# Altium project xunji_Project.PrjPCB
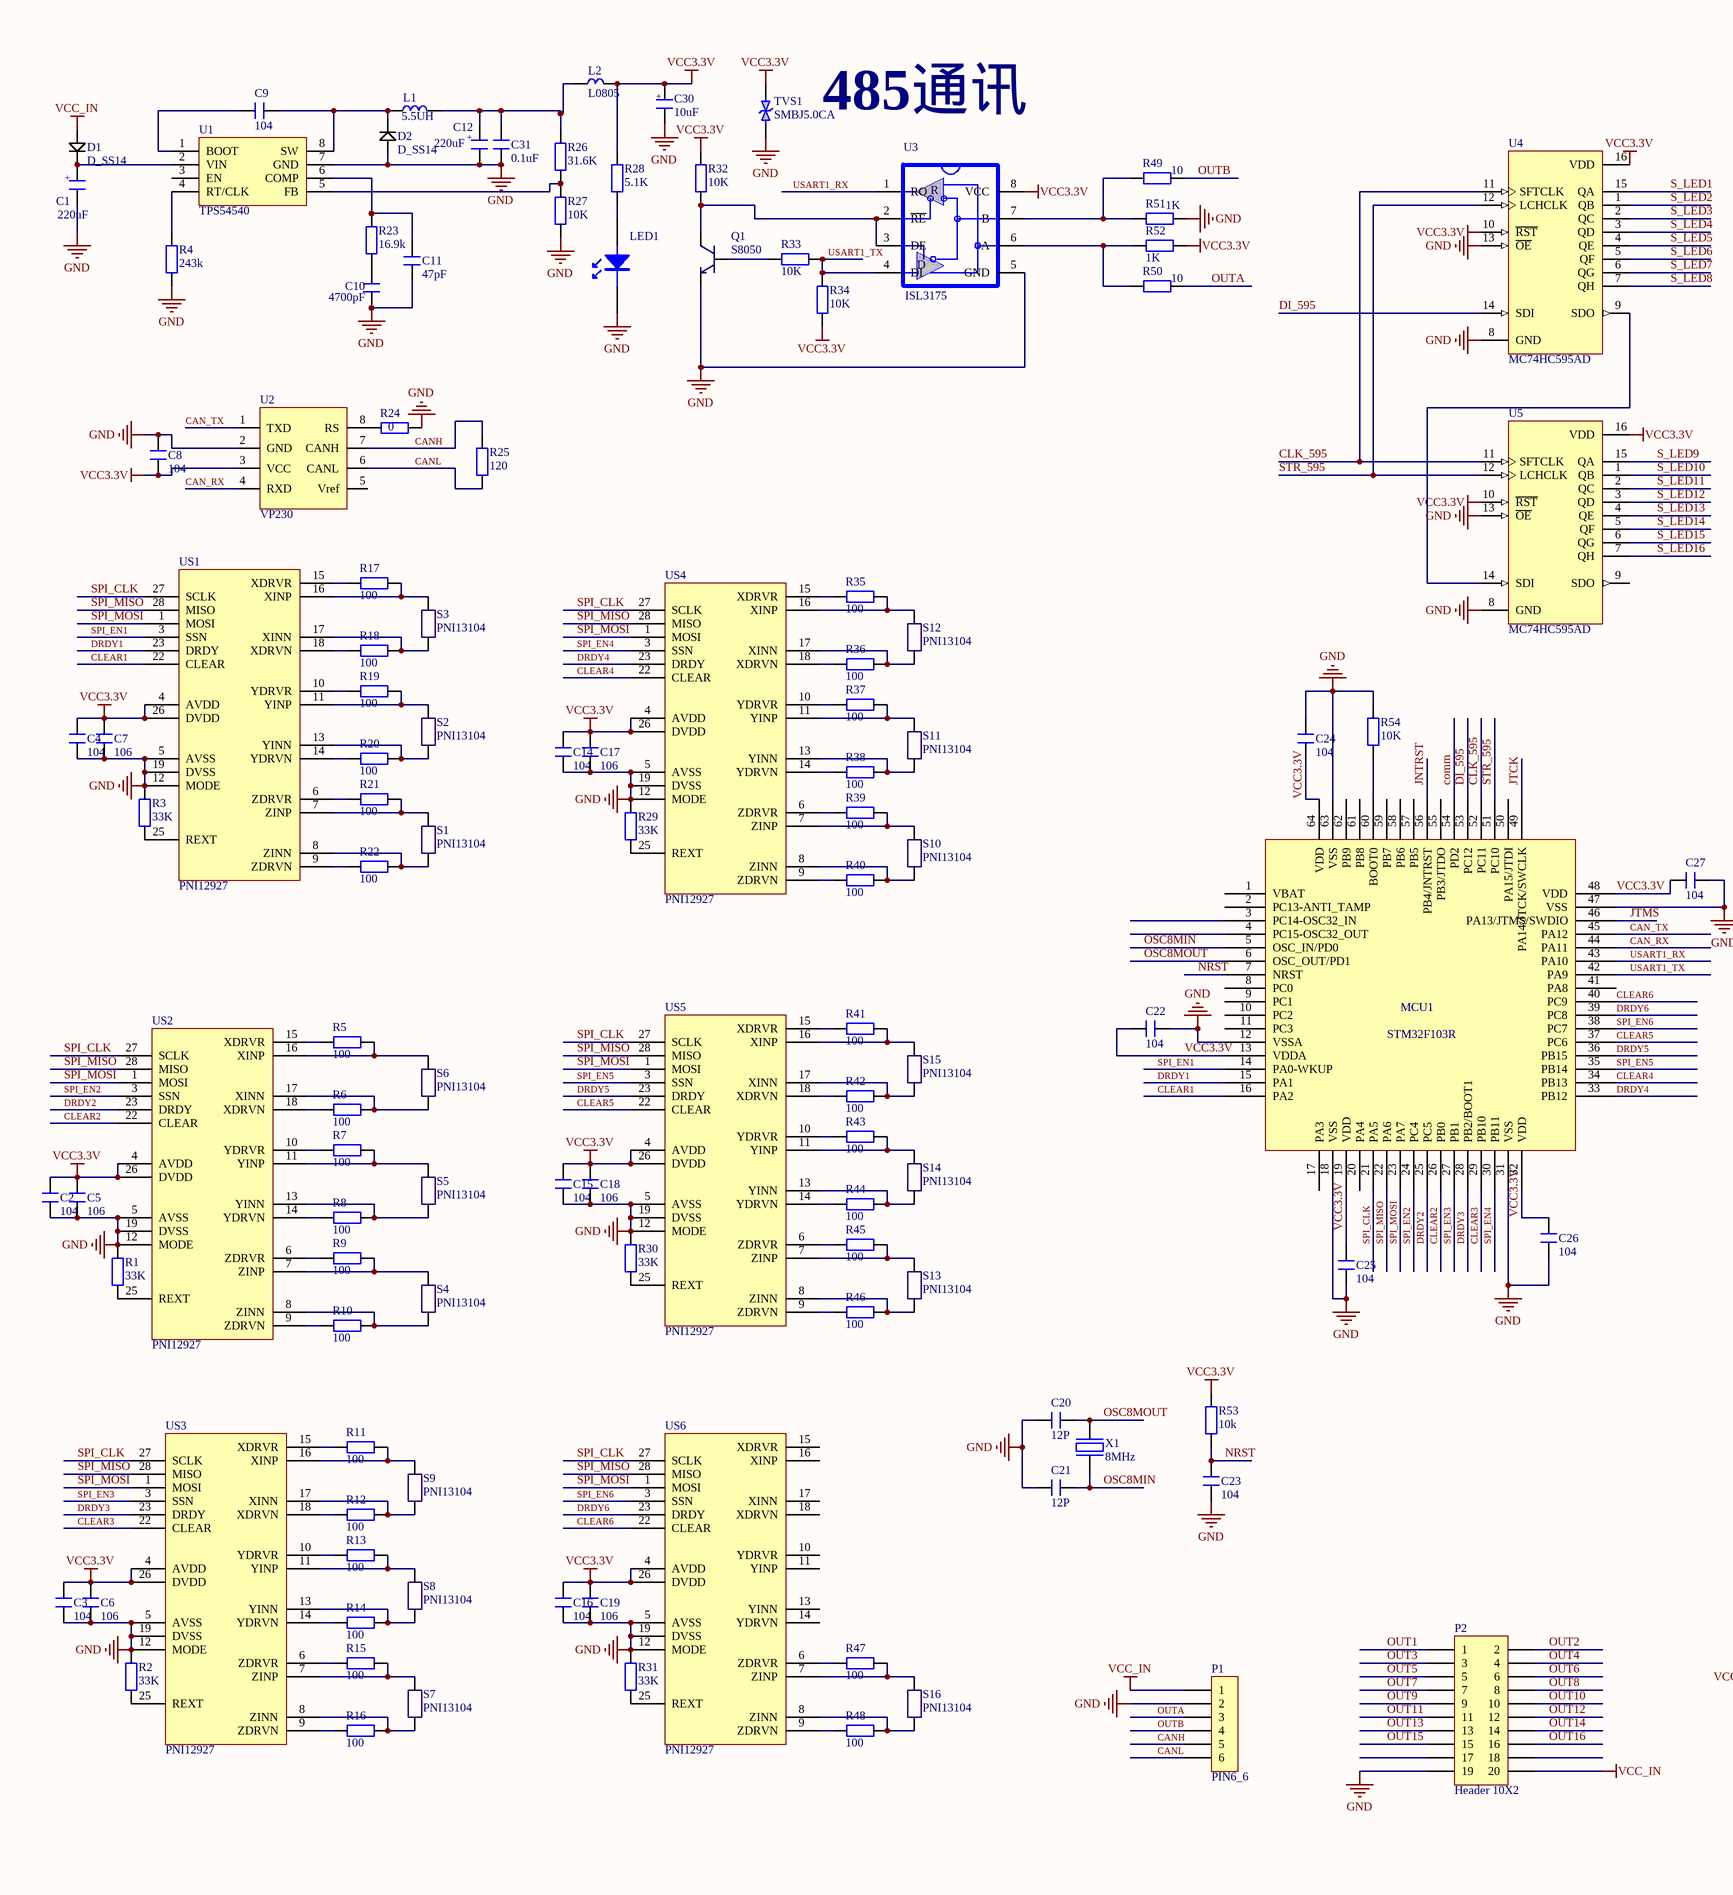
[diagram p0: MAIN.SchDoc, left]
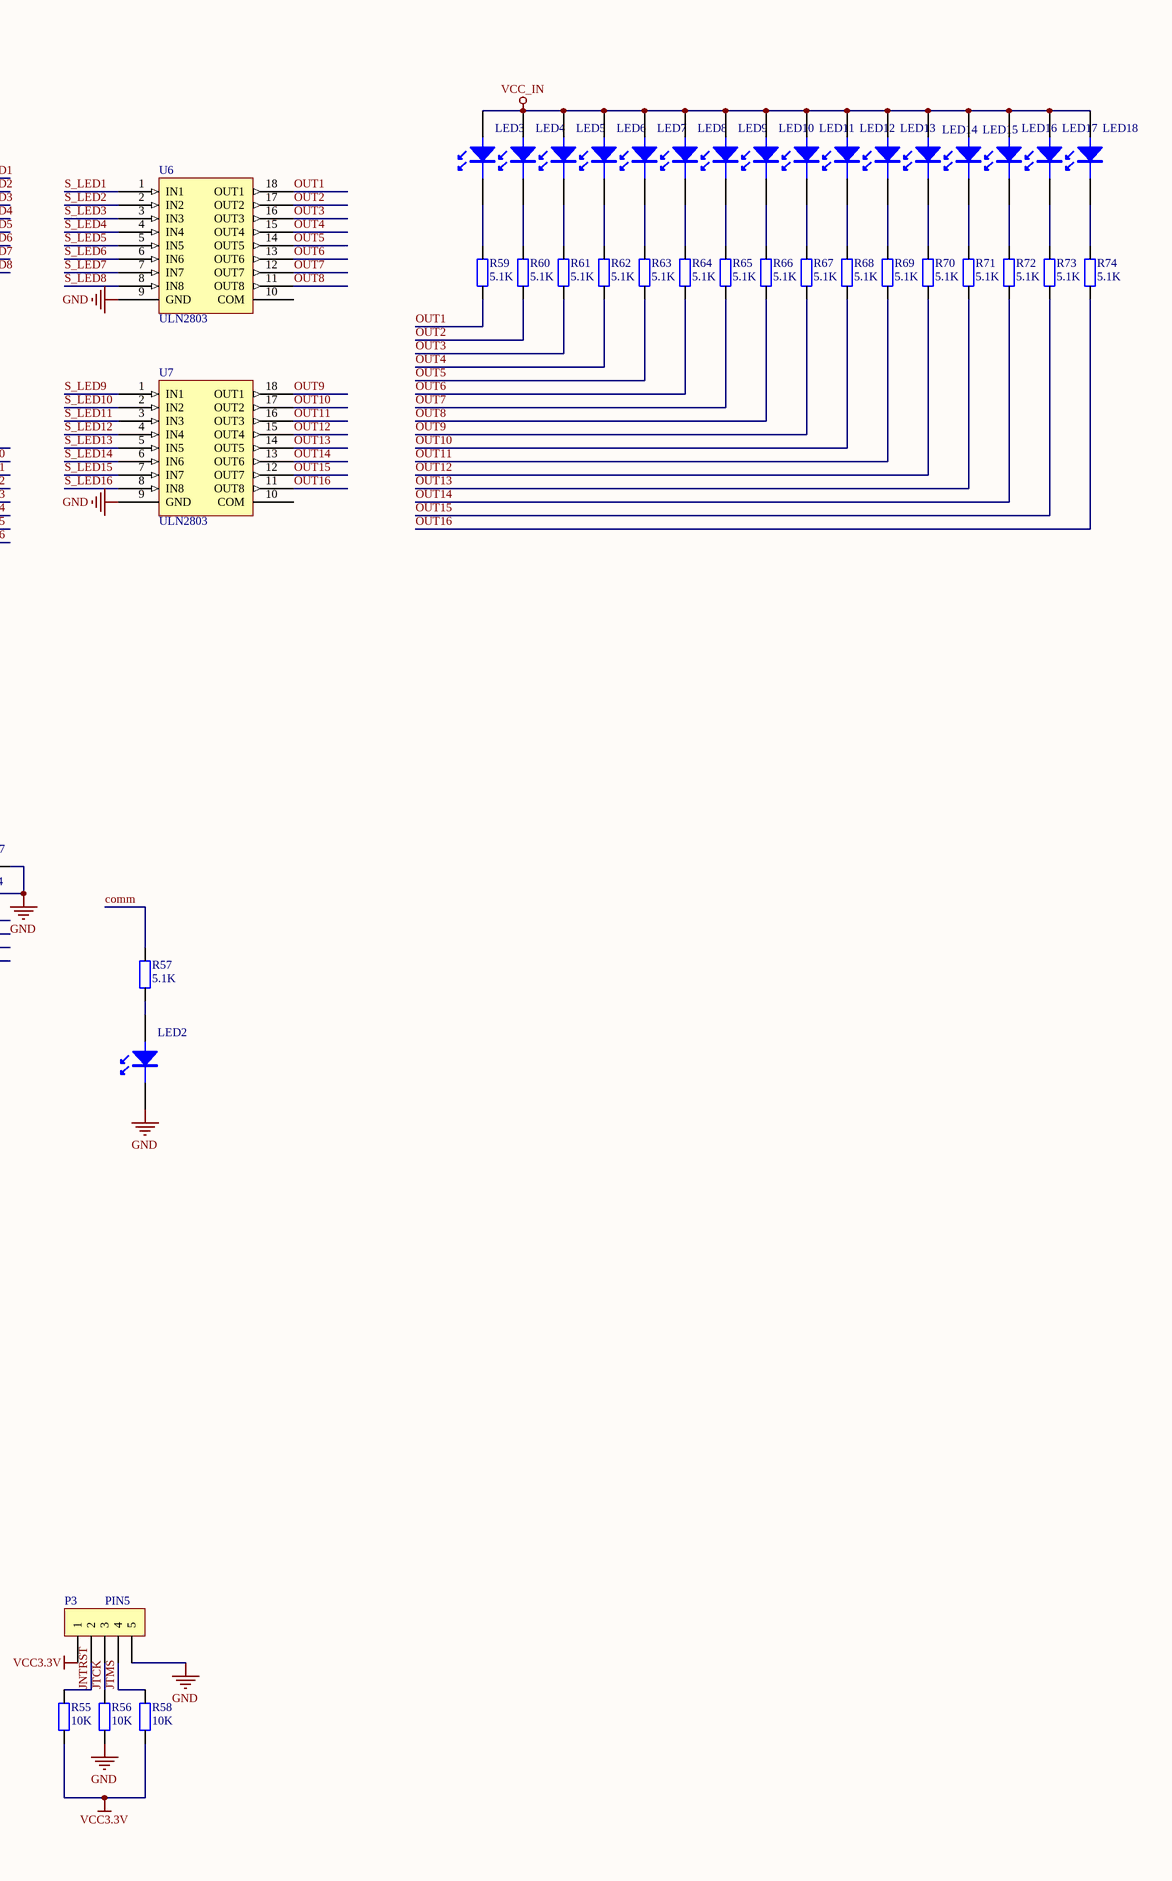
[diagram p1: MAIN.SchDoc, right]
1 sheet, 160 parts. Net scope: global (net labels, ports and power ports of the same name join across sheets).
Board file: XUNJI_V2.0.PcbDoc

## Sheet MAIN.SchDoc
size A2

### Parts
C1  220uF  [CAP_SMT_1]
C2  104  [C0603]
C3  104  [C0603]
C4  104  [C0603]
C5  106  [C0805]
C6  106  [C0805]
C7  106  [C0805]
C8  104  [C0603]
C9  104  [C0603]
C10  4700pF  [C0603]
C11  47pF  [C0603]
C12  220uF  [CAP_SMT_1]
C14  104  [C0603]
C15  104  [C0603]
C16  104  [C0603]
C17  106  [C0805]
C18  106  [C0805]
C19  106  [C0805]
C20  12P  [C0603]
C21  12P  [C0603]
C22  104  [C0603]
C23  104  [C0603]
C24  104  [C0603]
C25  104  [C0603]
C26  104  [C0603]
C27  104  [C0603]
C30  10uF  [C1206]
C31  0.1uF  [C0603]
D1  D_SS14  [D_3.0*5.0]
D2  D_SS14  [D_3.0*5.0]
L1  5.5UH  [L7*7]
L2  L0805  [L0805]
LED1  (no value)  [LED1-AK]
LED2  (no value)  [LED1-AK]
LED3  (no value)  [LED1-AK]
LED4  (no value)  [LED1-AK]
LED5  (no value)  [LED1-AK]
LED6  (no value)  [LED1-AK]
LED7  (no value)  [LED1-AK]
LED8  (no value)  [LED1-AK]
LED9  (no value)  [LED1-AK]
LED10  (no value)  [LED1-AK]
LED11  (no value)  [LED1-AK]
LED12  (no value)  [LED1-AK]
LED13  (no value)  [LED1-AK]
LED14  (no value)  [LED1-AK]
LED15  (no value)  [LED1-AK]
LED16  (no value)  [LED1-AK]
LED17  (no value)  [LED1-AK]
LED18  (no value)  [LED1-AK]
MCU1  STM32F103R  [TQFP64_STM32]
P1  PIN6_6  [KF350W_6]
P2  Header 10X2  [PIN20_10*2_2.54MM_1]
P3  PIN5  [PIN5_5*1_2.54MM_2]
Q1  S8050  [SOT-23]
R1  33K  [R0603]
R2  33K  [R0603]
R3  33K  [R0603]
R4  243k  [R0603]
R5  100  [R0603]
R6  100  [R0603]
R7  100  [R0603]
R8  100  [R0603]
R9  100  [R0603]
R10  100  [R0603]
R11  100  [R0603]
R12  100  [R0603]
R13  100  [R0603]
R14  100  [R0603]
R15  100  [R0603]
R16  100  [R0603]
R17  100  [R0603]
R18  100  [R0603]
R19  100  [R0603]
R20  100  [R0603]
R21  100  [R0603]
R22  100  [R0603]
R23  16.9k  [R0603]
R24  0  [R0603]
R25  120  [R0603]
R26  31.6K  [R0603]
R27  10K  [R0603]
R28  5.1K  [R0603]
R29  33K  [R0603]
R30  33K  [R0603]
R31  33K  [R0603]
R32  10K  [R0603]
R33  10K  [R0603]
R34  10K  [R0603]
R35  100  [R0603]
R36  100  [R0603]
R37  100  [R0603]
R38  100  [R0603]
R39  100  [R0603]
R40  100  [R0603]
R41  100  [R0603]
R42  100  [R0603]
R43  100  [R0603]
R44  100  [R0603]
R45  100  [R0603]
R46  100  [R0603]
R47  100  [R0603]
R48  100  [R0603]
R49  10  [R0603]
R50  10  [R0603]
R51  1K  [R0603]
R52  1K  [R0603]
R53  10k  [R0603]
R54  10K  [R0603]
R55  10K  [R0603]
R56  10K  [R0603]
R57  5.1K  [R0603]
R58  10K  [R0603]
R59  5.1K  [R0603]
R60  5.1K  [R0603]
R61  5.1K  [R0603]
R62  5.1K  [R0603]
R63  5.1K  [R0603]
R64  5.1K  [R0603]
R65  5.1K  [R0603]
R66  5.1K  [R0603]
R67  5.1K  [R0603]
R68  5.1K  [R0603]
R69  5.1K  [R0603]
R70  5.1K  [R0603]
R71  5.1K  [R0603]
R72  5.1K  [R0603]
R73  5.1K  [R0603]
R74  5.1K  [R0603]
S1  PNI13104  [PNI-13104]
S2  PNI13104  [PNI-13104]
S3  PNI13104  [PNI-13104]
S4  PNI13104  [PNI-13104]
S5  PNI13104  [PNI-13104]
S6  PNI13104  [PNI-13104]
S7  PNI13104  [PNI-13104]
S8  PNI13104  [PNI-13104]
S9  PNI13104  [PNI-13104]
S10  PNI13104  [PNI-13104]
S11  PNI13104  [PNI-13104]
S12  PNI13104  [PNI-13104]
S13  PNI13104  [PNI-13104]
S14  PNI13104  [PNI-13104]
S15  PNI13104  [PNI-13104]
S16  PNI13104  [PNI-13104]
TVS1  SMBJ5.0CA  [SMBJ6.5CA]
U1  TPS54540  [SOP8_1]
U2  VP230  [SOP8]
U3  ISL3175  [SO-8]
U4  MC74HC595AD  [SOP16]
U5  MC74HC595AD  [sop16]
U6  ULN2803  [SO-G18]
U7  ULN2803  [SO-G18]
US1  PNI12927  [MLF_28]
US2  PNI12927  [MLF_28]
US3  PNI12927  [MLF_28]
US4  PNI12927  [MLF_28]
US5  PNI12927  [MLF_28]
US6  PNI12927  [MLF_28]
X1  8MHz  [XTAL_49SMD]

### Nets
GND: C1.2 C2.1 C3.1 C4.1 C5.1 C6.1 C7.1 C8.2 C10.1 C11.1 C12.2 C14.1 C15.1 C16.1 C17.1 C18.1 C19.1 C20.1 C21.1 C22.2 C23.1 C24.2 C25.1 C26.1 C27.2 C30.2 C31.1 D2.1 LED1.K LED2.K MCU1.12(VSSA) MCU1.18(VSS) MCU1.31(VSS) MCU1.47(VSS) MCU1.63(VSS) P1.2 P2.19 P3.5 Q1.2 R1.2 R2.2 R3.2 R4.1 R24.2 R27.1 R29.2 R30.2 R31.2 R51.1 R54.2 R56.1 TVS1.1 U1.7(GND) U2.2(GND) U3.5(GND) U4.8(GND) U4.13(~{OE}) U5.8(GND) U5.13(~{OE}) U6.9(GND) U7.9(GND) US1.5(AVSS) US1.12(MODE) US1.19(DVSS) US2.5(AVSS) US2.12(MODE) US2.19(DVSS) US3.5(AVSS) US3.12(MODE) US3.19(DVSS) US4.5(AVSS) US4.12(MODE) US4.19(DVSS) US5.5(AVSS) US5.12(MODE) US5.19(DVSS) US6.5(AVSS) US6.12(MODE) US6.19(DVSS)
VCC3.3V: C2.2 C3.2 C4.2 C5.2 C6.2 C7.2 C8.1 C14.2 C15.2 C16.2 C17.2 C18.2 C19.2 C22.1 C24.1 C25.2 C26.2 C27.1 C30.1 L2.2 MCU1.13(VDDA) MCU1.19(VDD) MCU1.32(VDD) MCU1.48(VDD) MCU1.64(VDD) P3.1 R28.2 R32.1 R34.1 R52.1 R53.2 R55.1 R58.1 TVS1.2 U2.3(VCC) U3.8(VCC) U4.10(~{RST}) U4.16(VDD) U5.10(~{RST}) U5.16(VDD) US1.4(AVDD) US1.26(DVDD) US2.4(AVDD) US2.26(DVDD) US3.4(AVDD) US3.26(DVDD) US4.4(AVDD) US4.26(DVDD) US5.4(AVDD) US5.26(DVDD) US6.4(AVDD) US6.26(DVDD)
VCC_IN: D1.1 LED3.A LED4.A LED5.A LED6.A LED7.A LED8.A LED9.A LED10.A LED11.A LED12.A LED13.A LED14.A LED15.A LED16.A LED17.A LED18.A P1.1 P2.20
CAN_RX: MCU1.44(PA11) U2.4(RXD)
CAN_TX: MCU1.45(PA12) U2.1(TXD)
CANH: P1.5 R25.2 U2.7(CANH)
CANL: P1.6 R25.1 U2.6(CANL)
CLEAR1: MCU1.16(PA2) US1.22(CLEAR)
CLEAR2: MCU1.26(PB0) US2.22(CLEAR)
CLEAR3: MCU1.29(PB10) US3.22(CLEAR)
CLEAR4: MCU1.34(PB13) US4.22(CLEAR)
CLEAR5: MCU1.37(PC6) US5.22(CLEAR)
CLEAR6: MCU1.40(PC9) US6.22(CLEAR)
CLK_595: MCU1.52(PC11) U4.11(SFTCLK) U5.11(SFTCLK)
comm: MCU1.54(PD2) R57.2
DI_595: MCU1.53(PC12) U4.14(SDI)
DRDY1: MCU1.15(PA1) US1.23(DRDY)
DRDY2: MCU1.25(PC5) US2.23(DRDY)
DRDY3: MCU1.28(PB2/BOOT1) US3.23(DRDY)
DRDY4: MCU1.33(PB12) US4.23(DRDY)
DRDY5: MCU1.36(PB15) US5.23(DRDY)
DRDY6: MCU1.39(PC8) US6.23(DRDY)
JNTRST: MCU1.56(PB4/JNTRST) P3.2 R55.2
JTCK: MCU1.49(PA14/JTCK/SWCLK) P3.3 R56.2
JTMS: MCU1.46(PA13/JTMS/SWDIO) P3.4 R58.2
NRST: C23.2 MCU1.7(NRST) R53.1
OSC8MIN: C21.2 MCU1.5(OSC_IN/PD0) X1.1
OSC8MOUT: C20.2 MCU1.6(OSC_OUT/PD1) X1.2
OUT1: P2.1 R59.1 U6.18(OUT1)
OUT2: P2.2 R60.1 U6.17(OUT2)
OUT3: P2.3 R61.1 U6.16(OUT3)
OUT4: P2.4 R62.1 U6.15(OUT4)
OUT5: P2.5 R63.1 U6.14(OUT5)
OUT6: P2.6 R64.1 U6.13(OUT6)
OUT7: P2.7 R65.1 U6.12(OUT7)
OUT8: P2.8 R66.1 U6.11(OUT8)
OUT9: P2.9 R67.1 U7.18(OUT1)
OUT10: P2.10 R68.1 U7.17(OUT2)
OUT11: P2.11 R69.1 U7.16(OUT3)
OUT12: P2.12 R70.1 U7.15(OUT4)
OUT13: P2.13 R71.1 U7.14(OUT5)
OUT14: P2.14 R72.1 U7.13(OUT6)
OUT15: P2.15 R73.1 U7.12(OUT7)
OUT16: P2.16 R74.1 U7.11(OUT8)
OUTA: P1.3 R50.1
OUTB: P1.4 R49.1
S_LED1: U4.15(QA) U6.1(IN1)
S_LED2: U4.1(QB) U6.2(IN2)
S_LED3: U4.2(QC) U6.3(IN3)
S_LED4: U4.3(QD) U6.4(IN4)
S_LED5: U4.4(QE) U6.5(IN5)
S_LED6: U4.5(QF) U6.6(IN6)
S_LED7: U4.6(QG) U6.7(IN7)
S_LED8: U4.7(QH) U6.8(IN8)
S_LED9: U5.15(QA) U7.1(IN1)
S_LED10: U5.1(QB) U7.2(IN2)
S_LED11: U5.2(QC) U7.3(IN3)
S_LED12: U5.3(QD) U7.4(IN4)
S_LED13: U5.4(QE) U7.5(IN5)
S_LED14: U5.5(QF) U7.6(IN6)
S_LED15: U5.6(QG) U7.7(IN7)
S_LED16: U5.7(QH) U7.8(IN8)
SPI_CLK: MCU1.21(PA5) US1.27(SCLK) US2.27(SCLK) US3.27(SCLK) US4.27(SCLK) US5.27(SCLK) US6.27(SCLK)
SPI_EN1: MCU1.14(PA0-WKUP) US1.3(SSN)
SPI_EN2: MCU1.24(PC4) US2.3(SSN)
SPI_EN3: MCU1.27(PB1) US3.3(SSN)
SPI_EN4: MCU1.30(PB11) US4.3(SSN)
SPI_EN5: MCU1.35(PB14) US5.3(SSN)
SPI_EN6: MCU1.38(PC7) US6.3(SSN)
SPI_MISO: MCU1.22(PA6) US1.28(MISO) US2.28(MISO) US3.28(MISO) US4.28(MISO) US5.28(MISO) US6.28(MISO)
SPI_MOSI: MCU1.23(PA7) US1.1(MOSI) US2.1(MOSI) US3.1(MOSI) US4.1(MOSI) US5.1(MOSI) US6.1(MOSI)
STR_595: MCU1.51(PC10) U4.12(LCHCLK) U5.12(LCHCLK)
USART1_RX: MCU1.43(PA10) U3.1(RO)
USART1_TX: MCU1.42(PA9) R33.1 R34.2 U3.4(DI)
NetC1_1: C1.1 D1.2 U1.2(VIN)
NetC9_1: C9.1 D2.2 L1.1 U1.8(SW)
NetC9_2: C9.2 U1.1(BOOT)
NetC10_2: C10.2 R23.1
NetC11_2: C11.2 R23.2 U1.6(COMP)
NetC12_1: C12.1 C31.2 L1.2 L2.1 R26.2
NetLED1_A: LED1.A R28.1
NetLED2_A: LED2.A R57.1
NetLED3_K: LED3.K R59.2
NetLED4_K: LED4.K R60.2
NetLED5_K: LED5.K R61.2
NetLED6_K: LED6.K R62.2
NetLED7_K: LED7.K R63.2
NetLED8_K: LED8.K R64.2
NetLED9_K: LED9.K R65.2
NetLED10_K: LED10.K R66.2
NetLED11_K: LED11.K R67.2
NetLED12_K: LED12.K R68.2
NetLED13_K: LED13.K R69.2
NetLED14_K: LED14.K R70.2
NetLED15_K: LED15.K R71.2
NetLED16_K: LED16.K R72.2
NetLED17_K: LED17.K R73.2
NetLED18_K: LED18.K R74.2
NetMCU1_60: MCU1.60(BOOT0) R54.1
NetQ1_1: Q1.1 R33.2
NetQ1_3: Q1.3 R32.2 U3.2(~{RE}) U3.3(DE)
NetR1_1: R1.1 US2.25(REXT)
NetR2_1: R2.1 US3.25(REXT)
NetR3_1: R3.1 US1.25(REXT)
NetR4_2: R4.2 U1.4(RT/CLK)
NetR5_1: R5.1 US2.15(XDRVR)
NetR5_2: R5.2 S6.2 US2.16(XINP)
NetR6_1: R6.1 US2.18(XDRVN)
NetR6_2: R6.2 S6.1 US2.17(XINN)
NetR7_1: R7.1 US2.10(YDRVR)
NetR7_2: R7.2 S5.2 US2.11(YINP)
NetR8_1: R8.1 US2.14(YDRVN)
NetR8_2: R8.2 S5.1 US2.13(YINN)
NetR9_1: R9.1 US2.6(ZDRVR)
NetR9_2: R9.2 S4.2 US2.7(ZINP)
NetR10_1: R10.1 US2.9(ZDRVN)
NetR10_2: R10.2 S4.1 US2.8(ZINN)
NetR11_1: R11.1 US3.15(XDRVR)
NetR11_2: R11.2 S9.2 US3.16(XINP)
NetR12_1: R12.1 US3.18(XDRVN)
NetR12_2: R12.2 S9.1 US3.17(XINN)
NetR13_1: R13.1 US3.10(YDRVR)
NetR13_2: R13.2 S8.2 US3.11(YINP)
NetR14_1: R14.1 US3.14(YDRVN)
NetR14_2: R14.2 S8.1 US3.13(YINN)
NetR15_1: R15.1 US3.6(ZDRVR)
NetR15_2: R15.2 S7.2 US3.7(ZINP)
NetR16_1: R16.1 US3.9(ZDRVN)
NetR16_2: R16.2 S7.1 US3.8(ZINN)
NetR17_1: R17.1 US1.15(XDRVR)
NetR17_2: R17.2 S3.2 US1.16(XINP)
NetR18_1: R18.1 US1.18(XDRVN)
NetR18_2: R18.2 S3.1 US1.17(XINN)
NetR19_1: R19.1 US1.10(YDRVR)
NetR19_2: R19.2 S2.2 US1.11(YINP)
NetR20_1: R20.1 US1.14(YDRVN)
NetR20_2: R20.2 S2.1 US1.13(YINN)
NetR21_1: R21.1 US1.6(ZDRVR)
NetR21_2: R21.2 S1.2 US1.7(ZINP)
NetR22_1: R22.1 US1.9(ZDRVN)
NetR22_2: R22.2 S1.1 US1.8(ZINN)
NetR24_1: R24.1 U2.8(RS)
NetR26_1: R26.1 R27.2 U1.5(FB)
NetR29_1: R29.1 US4.25(REXT)
NetR30_1: R30.1 US5.25(REXT)
NetR31_1: R31.1 US6.25(REXT)
NetR35_1: R35.1 US4.15(XDRVR)
NetR35_2: R35.2 S12.2 US4.16(XINP)
NetR36_1: R36.1 US4.18(XDRVN)
NetR36_2: R36.2 S12.1 US4.17(XINN)
NetR37_1: R37.1 US4.10(YDRVR)
NetR37_2: R37.2 S11.2 US4.11(YINP)
NetR38_1: R38.1 US4.14(YDRVN)
NetR38_2: R38.2 S11.1 US4.13(YINN)
NetR39_1: R39.1 US4.6(ZDRVR)
NetR39_2: R39.2 S10.2 US4.7(ZINP)
NetR40_1: R40.1 US4.9(ZDRVN)
NetR40_2: R40.2 S10.1 US4.8(ZINN)
NetR41_1: R41.1 US5.15(XDRVR)
NetR41_2: R41.2 S15.2 US5.16(XINP)
NetR42_1: R42.1 US5.18(XDRVN)
NetR42_2: R42.2 S15.1 US5.17(XINN)
NetR43_1: R43.1 US5.10(YDRVR)
NetR43_2: R43.2 S14.2 US5.11(YINP)
NetR44_1: R44.1 US5.14(YDRVN)
NetR44_2: R44.2 S14.1 US5.13(YINN)
NetR45_1: R45.1 US5.6(ZDRVR)
NetR45_2: R45.2 S13.2 US5.7(ZINP)
NetR46_1: R46.1 US5.9(ZDRVN)
NetR46_2: R46.2 S13.1 US5.8(ZINN)
NetR47_1: R47.1 US6.6(ZDRVR)
NetR47_2: R47.2 S16.2 US6.7(ZINP)
NetR48_1: R48.1 US6.9(ZDRVN)
NetR48_2: R48.2 S16.1 US6.8(ZINN)
NetR49_2: R49.2 R51.2 U3.7(B)
NetR50_2: R50.2 R52.2 U3.6(A)
NetU4_9: U4.9(SDO) U5.14(SDI)

Not connected (* = marked no-connect by the designer): MCU1 1(VBAT) 2(PC13-ANTI_TAMP) 3(PC14-OSC32_IN) 4(PC15-OSC32_OUT) 8(PC0) 9(PC1) 10(PC2) 11(PC3) 17(PA3) 20(PA4) 41(PA8) 50(PA15/JTDI) 55(PB3/JTDO) 57(PB5) 58(PB6) 59(PB7) 61(PB8) 62(PB9); P2 17 18; U1 3(EN); U2 5(Vref); U5 9(SDO); U6 10(COM); U7 10(COM); US6 10(YDRVR) 11(YINP) 13(YINN) 14(YDRVN) 15(XDRVR) 16(XINP) 17(XINN) 18(XDRVN)

### Notes on the sheet
- 485通讯
- (in symbol CAP_SMT_1) +
- (in symbol CAP_SMT_1206) +
- (in symbol MAX485) R; D

### Library data of the parts
C1 C12 = CAP_SMT_1
C2-C4 C8-C11 C14-C16 C20-C27 C31 = CAP_SMT_0603
C5-C7 C17-C19 = CAP_SMT_0805
C30 = CAP_SMT_1206
L1 = L_SMT_7*7*4
L2 = L_SMT_0805
LED1-LED18 = LED
MCU1 = STM32F103RXX_64
P1 = PIN6_6*1_3.81MM
P2 = Header 10X2: Header, 10-Pin, Dual row; LatestRevisionDate: 17-Jul-2002; LatestRevisionNote: Re-released for DXP Platform.; Publisher: Altium Limited
P3 = PIN5_5*1_2.54mm
Q1 = QS8050
R1-R74 = RES_SMT_0603
TVS1 = TVS: 片式瞬态抑制二极管
U3 = MAX485
U4 U5 = MC74HC595AD: 8-Bit Serial-Input/Serial or Prallel-Output Shift Register with Latched 3-State Outputs; Published: 15-Apr-2002; LatestRevisionDate: 13-Apr-2006; LatestRevisionNote: IPC-7351 Footprint Added.; DatasheetVersion: Mar-2000; PackageVersion: Oct-1999; PackageReference: 751B-05; Publisher: Altium Limited; PackageDescription: 16-Pin Small Outline Integrated Circuit 1.27 mm Pitch; Code_JEDEC: MS-012-AC; Code_IPC: SOIC127P600-16; ComponentLink1Description: Manufacturer Link; ComponentLink1URL: http://www.onsemi.com/; ComponentLink2Description: Datasheet; ComponentLink2URL: http://www.onsemi.com/pub/Collateral/MC74HC595A-D.PDF
X1 = XTAL_49SMD: 假贴片晶振